# EAGLE design schematic (EAGLE 7.1.0)
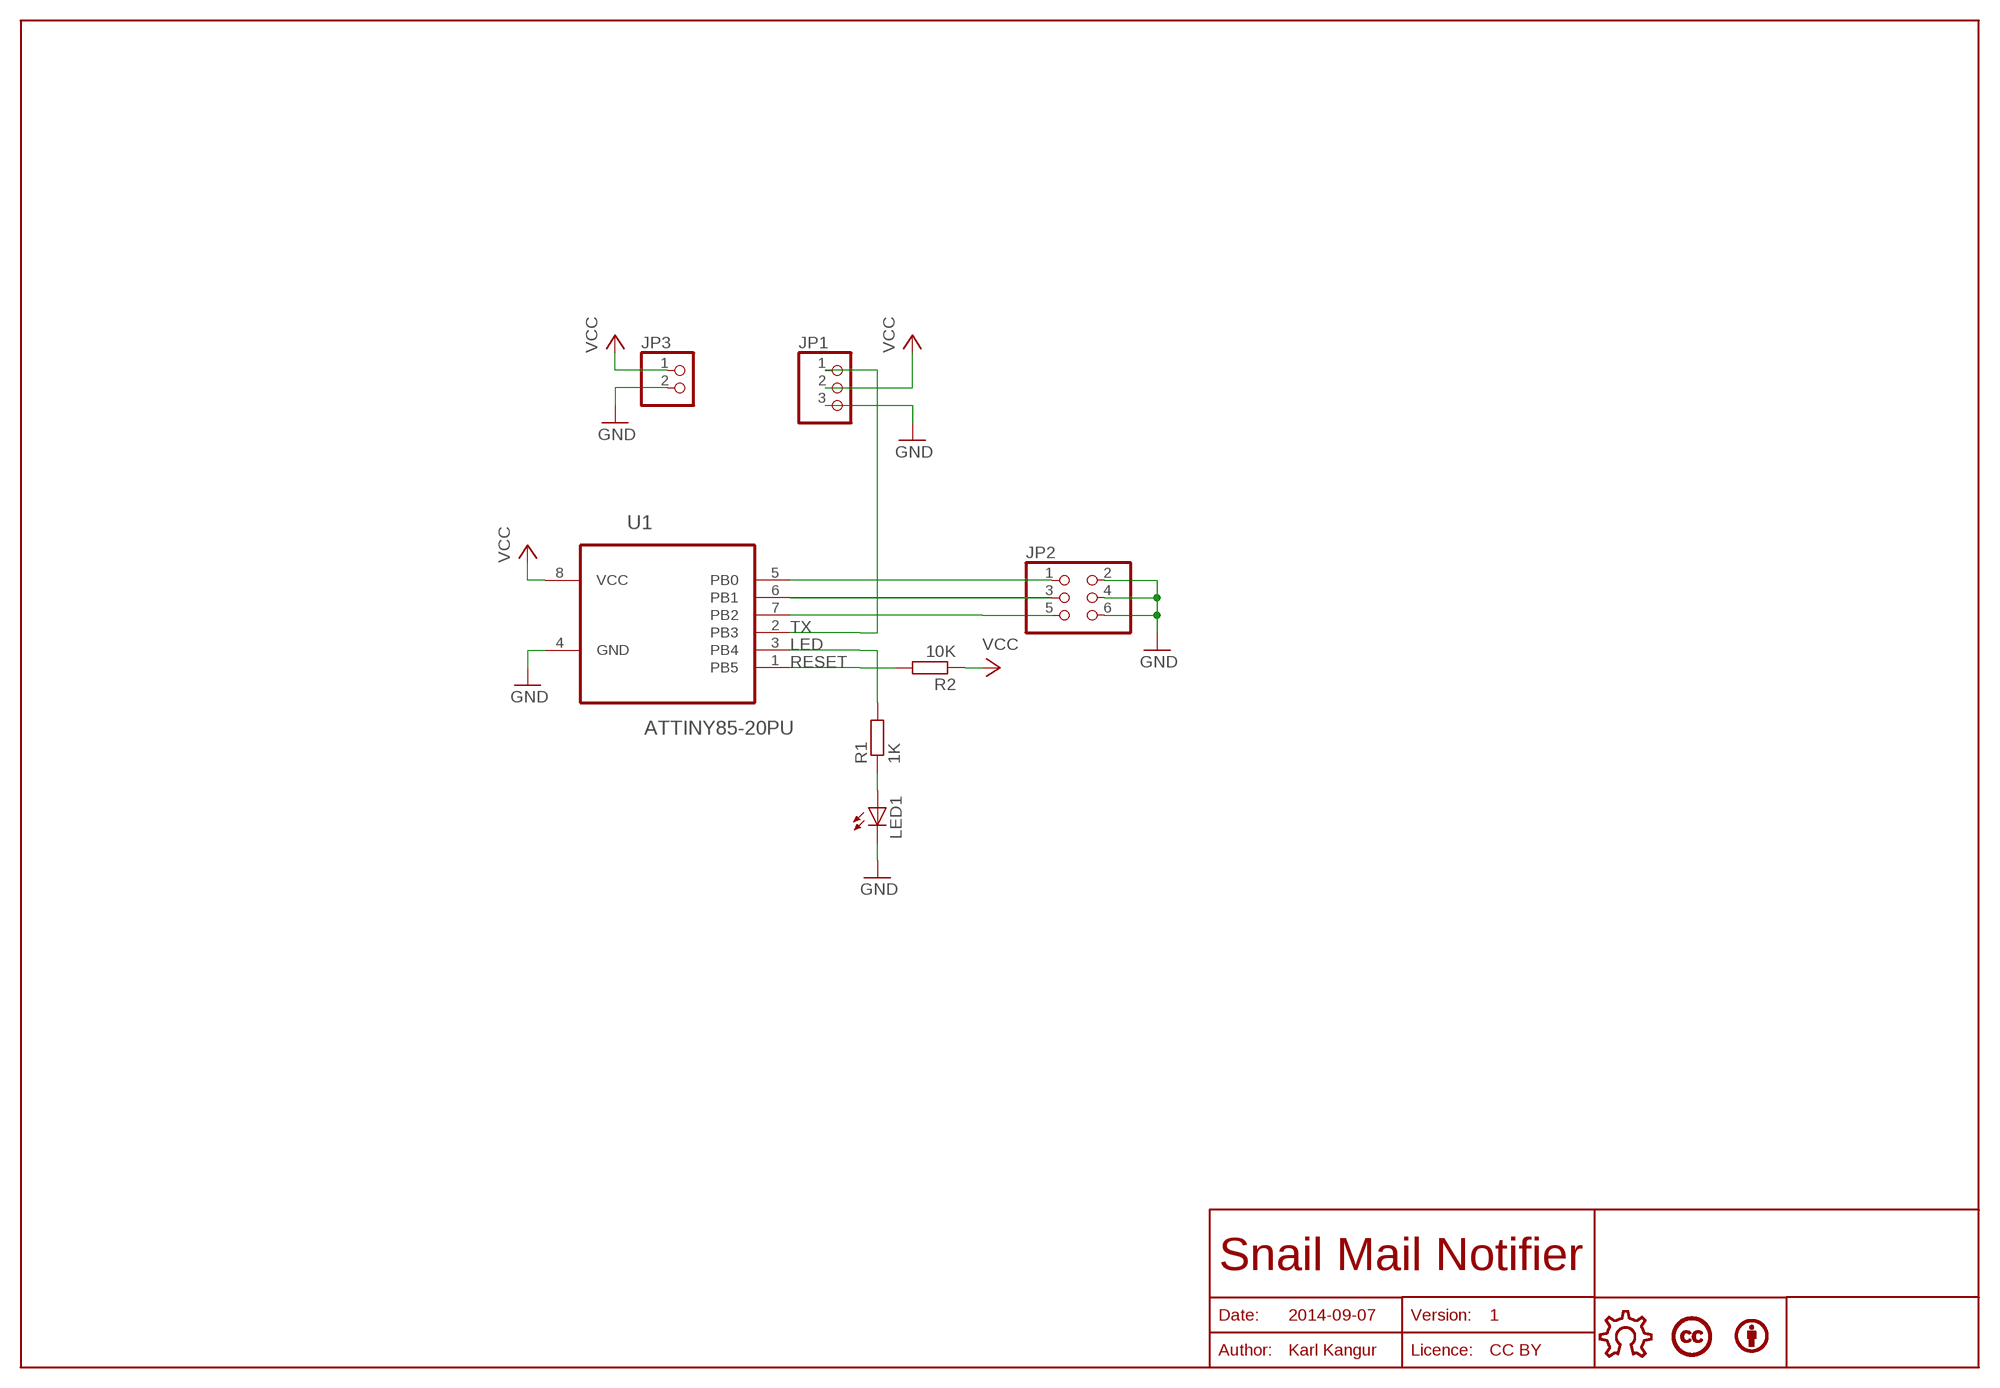
[diagram p0: schematic, sheet 1]

## Parts
BY1  BYBOTTOM  [BY]
JP1  PINHD-1X3  [1X03]
JP2  PINHD-2X3  [2X03]
JP3  PINHD-1X2/90  [1X02/90]
LED1  LED3MM  [LED3MM]
LICENCE1  LICENCECC-BOTTOM  [CREATIVE-COMMONS]
R1  1K  R-EU_R0805  [R0805]
R2  10K  R-EU_R0805  [R0805]
U1  ATTINY85-20PU  [DIP254P762X533-8]
U$5  OPEN-HARDWARE-LOGOBOTTOM-SMALL  [OPEN-HARDWARE-BOTTOM-SMALL]

## Nets
GND: JP1.3 JP2.2 JP2.4 JP2.6 JP3.2 LED1.K(C)
LED: R1.2 U1.3(PB4)
N$1: LED1.A R1.1
N$2: JP2.1 U1.5(PB0)
N$3: JP2.3 U1.6(PB1)
N$4: JP2.5 U1.7(PB2)
RESET: R2.2 U1.1(PB5)
TX: JP1.1 U1.2(PB3)
VCC: JP1.2 JP3.1 R2.1
Unconnected: U1.4(GND)

## Notes on the sheet
- Snail Mail Notifier
- Date: | 2014-09-07 | Version: | 1
- Author: | Karl Kangur | Licence: | CC BY

## Power pins joined to a net without a drawn wire
VCC: U1.8(VCC)

## Library data of the parts
BY1 = robopoly:BY
JP1 = pinhead:PINHD-1X3: PIN HEADER
JP2 = pinhead:PINHD-2X3: PIN HEADER
JP3 = pinhead:PINHD-1X2: PIN HEADER
LED1 = led:LED: LED OSRAM: - CHIPLED LG R971, LG N971, LY N971, LG Q971, LY Q971, LO R971, LY R971 LH N974, LH R974 LS Q976, LO Q976, LY Q976 LO Q996 - Hyper CHIPLED LW Q18S LB Q993, LB Q99A, LB R99A - SideLED LS A670, LO A670, LY A670, LG A670, LP A670 LB A673, LV A673, LT A673, LW A673 LH A674 LY A675 LS A676, LA A676, LO A676, LY A676, LW A676 LS A679, LY A679, LG A679 - Hyper Micro SIDELED® LS Y876, LA Y876, LO Y876, LY Y876 LT Y87S - SmartLED LW L88C, LW L88S LB L89C, LB L89S, LG L890 LS L89K, LO L89K, LY L89K LS L896, LA L896, LO L896, LY L896 - TOPLED LS T670, LO T670, LY T670, LG T670, LP T670 LSG T670, LSP T670, LSY T670, LOP T670, LYG T670 LG T671, LOG T671, LSG T671 LB T673, LV T673, LT T673, LW T673 LH T674 LS T676, LA T676, LO T676, LY T676, LB T676, LH T676, LSB T676, LW T676 LB T67C, LV T67C, LT T67C, LS T67K, LO T67K, LY T67K, LW E67C LS E67B, LA E67B, LO E67B, LY E67B, LB E67C, LV E67C, LT E67C LW T67C LS T679, LY T679, LG T679 LS T770, LO T770, LY T770, LG T770, LP T770 LB T773, LV T773, LT T773, LW T773 LH T774 LS E675, LA E675, LY E675, LS T675 LS T776, LA T776, LO T776, LY T776, LB T776 LHGB T686 LT T68C, LB T68C - Hyper Mini TOPLED® LB M676 - Mini TOPLED Santana® LG M470 LS M47K, LO M47K, LY M47K Source: http://www.osram.convergy.de LUXEON: - LUMILED® LXK2-PW12-R00, LXK2-PW12-S00, LXK2-PW14-U00, LXK2-PW14-V00 LXK2-PM12-R00, LXK2-PM12-S00, LXK2-PM14-U00 LXK2-PE12-Q00, LXK2-PE12-R00, LXK2-PE12-S00, LXK2-PE14-T00, LXK2-PE14-U00 LXK2-PB12-K00, LXK2-PB12-L00, LXK2-PB12-M00, LXK2-PB14-N00, LXK2-PB14-P00, LXK2-PB14-Q00 LXK2-PR12-L00, LXK2-PR12-M00, LXK2-PR14-Q00, LXK2-PR14-R00 LXK2-PD12-Q00, LXK2-PD12-R00, LXK2-PD12-S00 LXK2-PH12-R00, LXK2-PH12-S00 LXK2-PL12-P00, LXK2-PL12-Q00, LXK2-PL12-R00 Source: www.luxeon.com KINGBRIGHT: KA-3528ASYC Source: www.kingbright.com
LICENCE1 = robopoly:LICENCE
R1 R2 = resistor:R-EU_: RESISTOR, European symbol
U1 = Atmel_By_element14_Batch_1-00:ATTINY85-20PU: 8-bit Microcontroller with In-System Programmable Flash; MPN: ATTINY85-20PU; OC_FARNELL: 1455162; OC_NEWARK: 58M3796; PACKAGE: PDIP-8; SUPPLIER: Atmel
U$5 = robopoly:OPEN-HARDWARE-LOGO

## Board
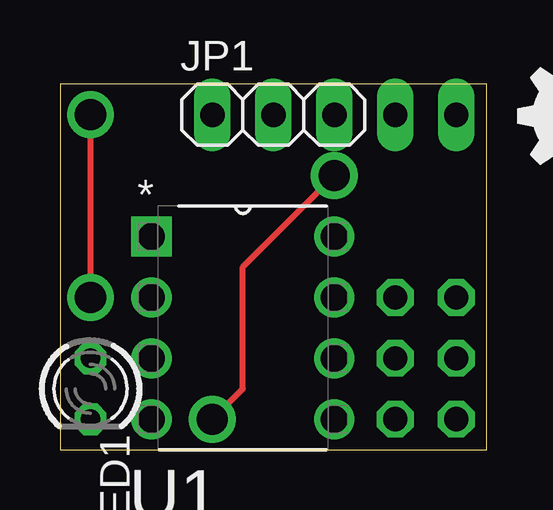
[diagram p1: board, top side]
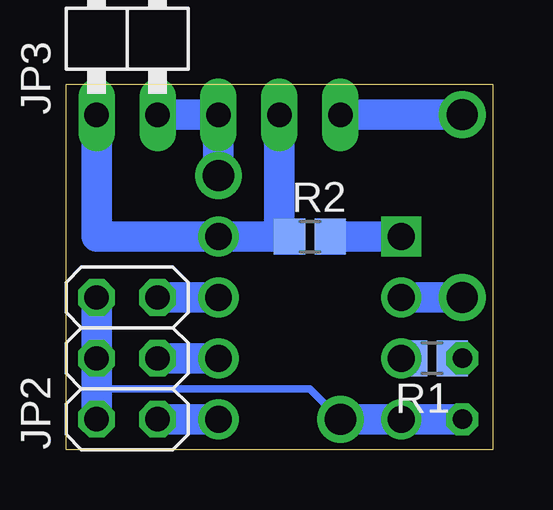
[diagram p2: board, bottom side, seen from below]

Size 17.78 x 15.24 mm. Coordinates in mm from the lower left corner, seen from the top.
Outline: 0,0 17.78,0 17.78,15.24 0,15.24 0,0
Copper layers (1*16): Top 0.035mm / dielectric 1.5mm / Bottom 0.035mm
Design rules "default": minimum track width 10mil, minimum drill 24mil, track to track 8mil, track to pad 8mil, pad to pad 8mil, via to via 8mil, smd to smd 8mil, copper to edge 40mil, drill to drill 8mil, minimum pad ring 10mil, minimum via ring 8mil, stop-mask expansion 4mil, vias tented up to drill 0mil, thermal gap 10mil

### Footprints (pad centres in the part's own frame; a part is rotated, then mirrored left to right if it is on the bottom)
1X03 = drill 1.016 long: 1 -2.54,0; 2 0,0; 3 2.54,0
2X03 = drill 1.016 octagon: 1 -2.54,-1.27; 2 -2.54,1.27; 3 0,-1.27; 4 0,1.27; 5 2.54,-1.27; 6 2.54,1.27
1X02/90 = drill 1.016 long: 1 -1.27,-3.81; 2 1.27,-3.81
LED3MM = drill 0.813 octagon: A -1.27,0; K 1.27,0
R0805 = smd 1.3 x 1.5: 1 -0.85,0; 2 0.85,0
DIP254P762X533-8 = drill 1.118 square: 1 -7.62,7.62 | drill 1.118: 2 -7.62,5.08; 3 -7.62,2.54; 4 -7.62,0; 5 0,0; 6 0,2.54; 7 0,5.08; 8 0,7.62

### Placement (x,y rotation side)
BY1  34.29,13.97 0 bottom  (outside the outline)
JP1  8.89,13.97 0 top
JP2  15.24,3.81 90 bottom
JP3  15.24,17.78 0 bottom
LED1  1.27,2.54 270 top
LICENCE1  27.94,13.97 0 bottom  (outside the outline)
R1  2.54,3.81 180 bottom
R2  7.62,8.89 0 bottom
U1  11.43,1.27 0 top
U$5  21.59,13.97 0 bottom  (outside the outline)

### Tracks (layer width: path | path; a pad name or v marks a point on that pad's centre or on a via)
GND  (via drill 1.3)
  Top 0.254: v6.35,1.27 7.62,2.54 7.62,7.62 v11.43,11.43
  Bottom 0.305: v6.35,1.27 7.62,2.54 16.51,2.54
  Bottom 1.27: JP2.6 JP2.4 16.51,2.54 JP2.2 | JP3.2 JP1.3 v11.43,11.43 | LED1.K v6.35,1.27
LED
  Bottom 1.27: U1.3 R1.2
N$1
  Bottom 1.27: LED1.A R1.1
N$2
  Bottom 1.27: JP2.1 U1.5
N$3
  Bottom 1.27: U1.6 JP2.3
N$4
  Bottom 1.27: JP2.5 U1.7
RESET
  Bottom 1.27: U1.1 R2.2
TX  (via drill 1.3)
  Top 0.254: v1.27,13.97 v1.27,6.35
  Bottom 1.27: JP1.1 v1.27,13.97 | U1.2 v1.27,6.35
VCC
  Bottom 1.27: JP1.2 8.89,8.89 | JP3.1 16.51,8.89 U1.8 8.89,8.89 | 8.89,8.89 R2.1

### Text on the board
Document: Snail Mail Notifier | Version: 1 | 2014-09-07 | Author: Karl Kangur | Licence: CC-BY